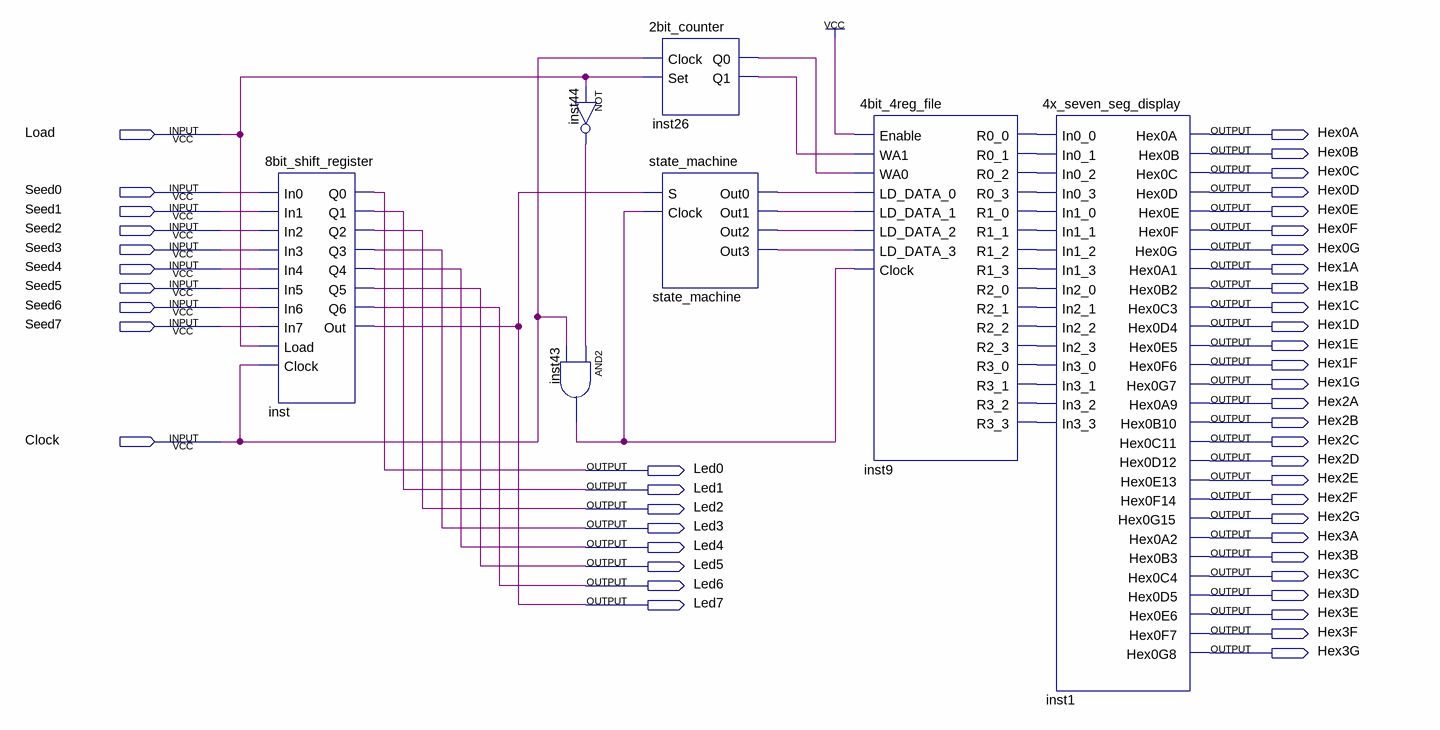
[diagram p0: schematic sheet]
// Quartus schematic ce281final.bdf as structural Verilog: 7 symbols, 46 pins
module ce281final (
  input  Load,
  input  Seed0,
  input  Seed1,
  input  Seed2,
  input  Seed3,
  input  Seed4,
  input  Seed5,
  input  Seed6,
  input  Seed7,
  input  Clock,
  output Hex0A,
  output Hex0B,
  output Hex0C,
  output Hex0D,
  output Hex0E,
  output Hex0F,
  output Hex0G,
  output Hex1A,
  output Hex1B,
  output Hex1C,
  output Hex1D,
  output Hex1E,
  output Hex1F,
  output Hex1G,
  output Hex2A,
  output Hex2B,
  output Hex2C,
  output Hex2D,
  output Led0,
  output Hex2E,
  output Led1,
  output Hex2F,
  output Led2,
  output Hex2G,
  output Led3,
  output Hex3A,
  output Led4,
  output Hex3B,
  output Led5,
  output Hex3C,
  output Led6,
  output Hex3D,
  output Led7,
  output Hex3E,
  output Hex3F,
  output Hex3G
);

  wire inst9_r0_0, inst9_r0_1, inst9_r0_2, inst9_r0_3, inst9_r1_0, inst9_r1_1, inst9_r1_2, inst9_r1_3,
       inst9_r2_0, inst9_r2_1, inst9_r2_2, inst9_r2_3, inst9_r3_0, inst9_r3_1, inst9_r3_2, inst9_r3_3,
       inst26_q0, inst26_q1, inst43_out, inst44_out, state_machine_out0, state_machine_out1,
       state_machine_out2, state_machine_out3;

  \8bit_shift_register  inst (
    .In0(Seed0), .In1(Seed1), .In2(Seed2), .In3(Seed3), .In4(Seed4), .In5(Seed5), .In6(Seed6), .In7(Seed7),
    .Load(Load), .Clock(Clock), .Q0(Led0), .Q1(Led1), .Q2(Led2), .Q3(Led3), .Q4(Led4), .Q5(Led5), .Q6(Led6),
    .Out(Led7));
  not inst44 (inst44_out, Load);
  and inst43 (inst43_out, inst44_out, Clock);
  \2bit_counter  inst26 (.Clock(Clock), .Set(Load), .Q0(inst26_q0), .Q1(inst26_q1));
  state_machine state_machine (
    .S(Led7), .Clock(inst43_out), .Out0(state_machine_out0), .Out1(state_machine_out1),
    .Out2(state_machine_out2), .Out3(state_machine_out3));
  \4bit_4reg_file  inst9 (
    .Enable(1'b1), .WA1(inst26_q1), .WA0(inst26_q0), .LD_DATA_0(state_machine_out0),
    .LD_DATA_1(state_machine_out1), .LD_DATA_2(state_machine_out2), .LD_DATA_3(state_machine_out3),
    .Clock(inst43_out), .R0_0(inst9_r0_0), .R0_1(inst9_r0_1), .R0_2(inst9_r0_2), .R0_3(inst9_r0_3),
    .R1_0(inst9_r1_0), .R1_1(inst9_r1_1), .R1_2(inst9_r1_2), .R1_3(inst9_r1_3), .R2_0(inst9_r2_0),
    .R2_1(inst9_r2_1), .R2_2(inst9_r2_2), .R2_3(inst9_r2_3), .R3_0(inst9_r3_0), .R3_1(inst9_r3_1),
    .R3_2(inst9_r3_2), .R3_3(inst9_r3_3));
  \4x_seven_seg_display  inst1 (
    .In0_0(inst9_r0_0), .In0_1(inst9_r0_1), .In0_2(inst9_r0_2), .In0_3(inst9_r0_3), .In1_0(inst9_r1_0),
    .In1_1(inst9_r1_1), .In1_2(inst9_r1_2), .In1_3(inst9_r1_3), .In2_0(inst9_r2_0), .In2_1(inst9_r2_1),
    .In2_2(inst9_r2_2), .In2_3(inst9_r2_3), .In3_0(inst9_r3_0), .In3_1(inst9_r3_1), .In3_2(inst9_r3_2),
    .In3_3(inst9_r3_3), .Hex0A(Hex0A), .Hex0B(Hex0B), .Hex0C(Hex0C), .Hex0D(Hex0D), .Hex0E(Hex0E),
    .Hex0F(Hex0F), .Hex0G(Hex0G), .Hex0A1(Hex1A), .Hex0B2(Hex1B), .Hex0C3(Hex1C), .Hex0D4(Hex1D),
    .Hex0E5(Hex1E), .Hex0F6(Hex1F), .Hex0G7(Hex1G), .Hex0A9(Hex2A), .Hex0B10(Hex2B), .Hex0C11(Hex2C),
    .Hex0D12(Hex2D), .Hex0E13(Hex2E), .Hex0F14(Hex2F), .Hex0G15(Hex2G), .Hex0A2(Hex3A), .Hex0B3(Hex3B),
    .Hex0C4(Hex3C), .Hex0D5(Hex3D), .Hex0E6(Hex3E), .Hex0F7(Hex3F), .Hex0G8(Hex3G));
endmodule
